# EAGLE board ARM_board (EAGLE 6.5.0), part 1 of 3
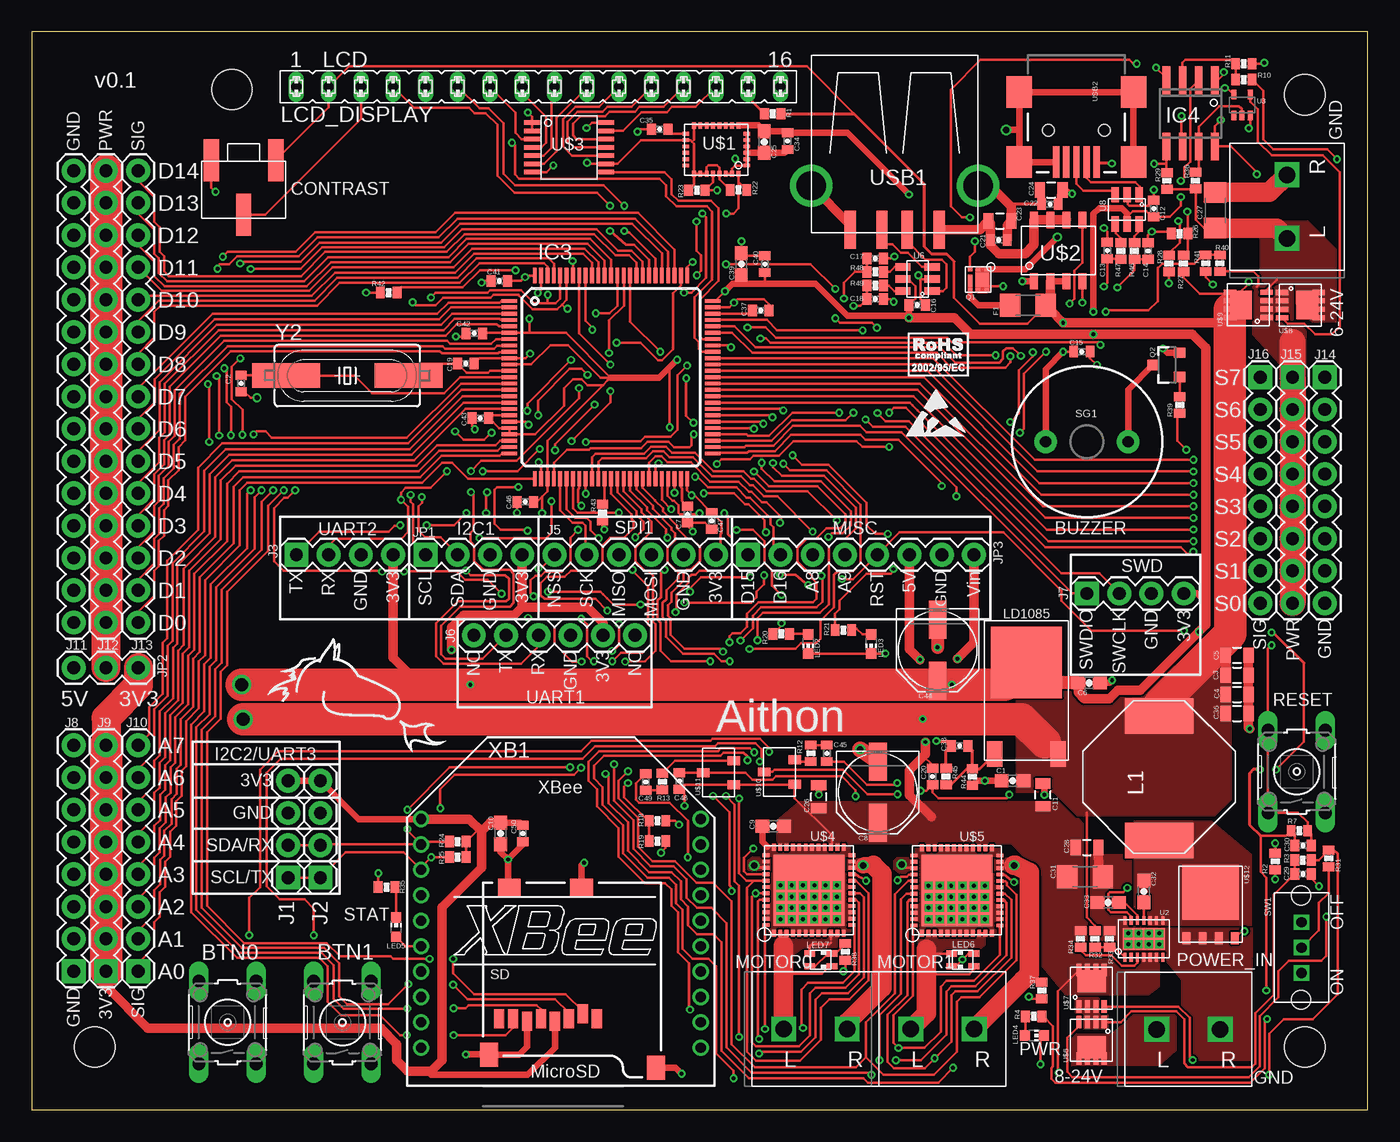
[diagram p2: board, top side]
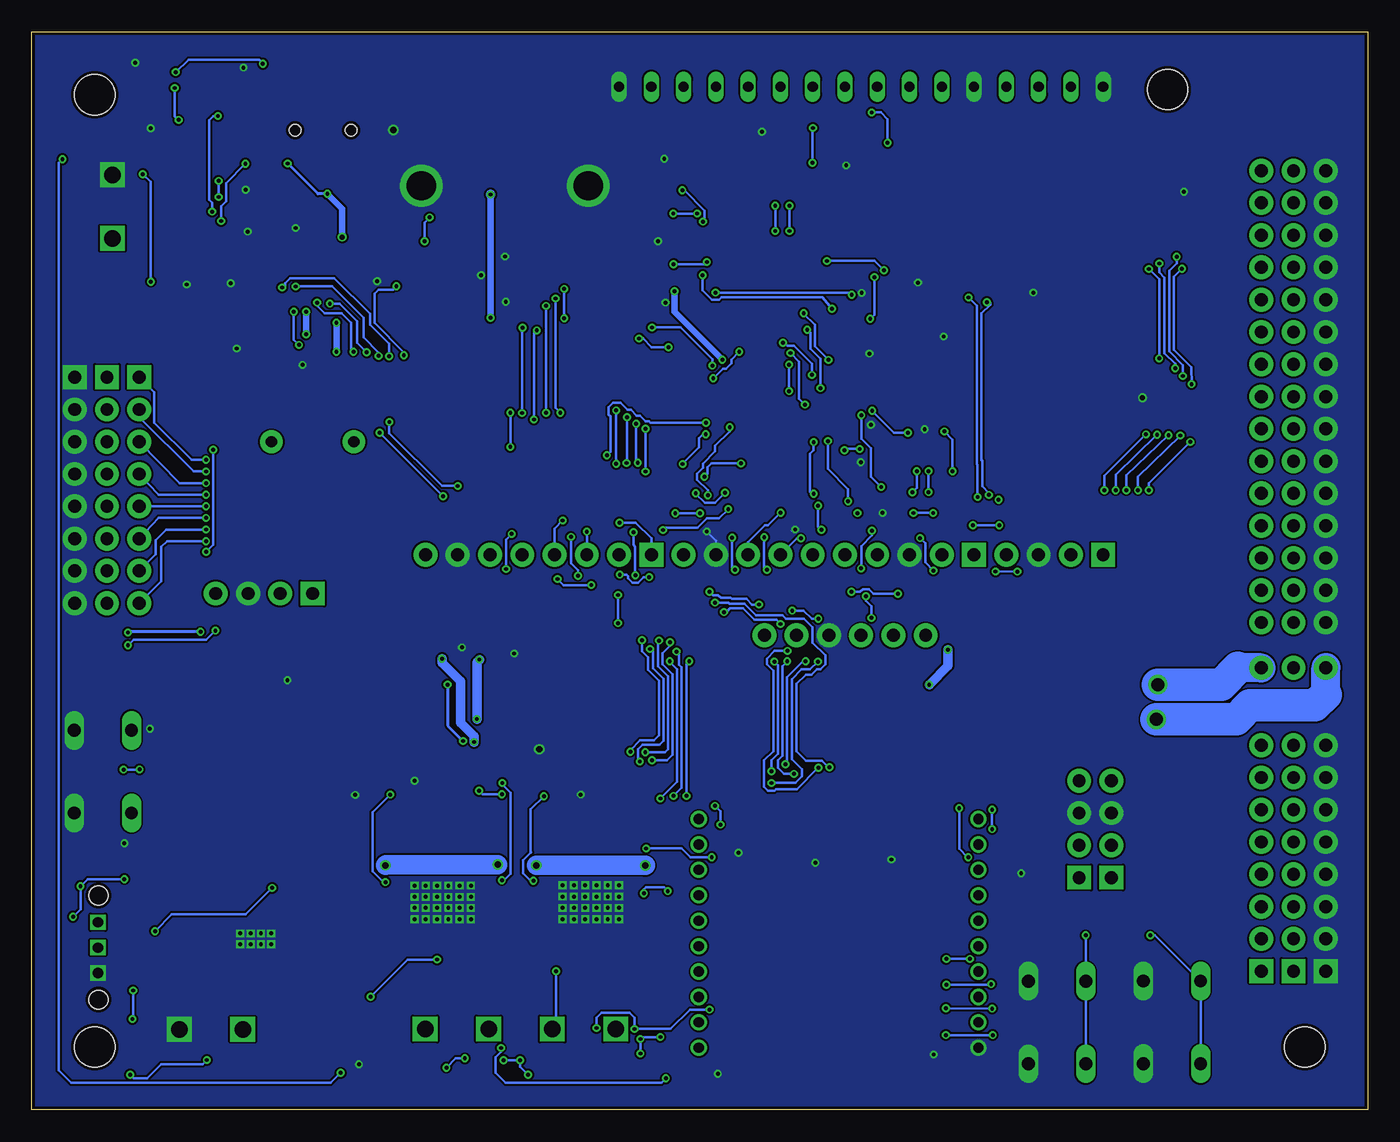
[diagram p3: board, bottom side, seen from below]

Size 105.16 x 84.84 mm. Coordinates in mm from the lower left corner, seen from the top.
Outline: 0,0 105.16,0 105.16,84.84 0,84.84 0,0
Copper layers (1*2*15*16): Top 0.035mm / dielectric 0.2mm / layer 2 0.0175mm / dielectric 1.1mm / layer 15 0.0175mm / dielectric 0.2mm / Bottom 0.035mm
Design rules: minimum track width 6mil, minimum drill 12mil, track to track 6mil, track to pad 6mil, pad to pad 6mil, via to via 6mil, smd to smd 0mil, copper to edge 10mil, drill to drill 10mil, minimum pad ring 6mil, minimum via ring 6mil, stop-mask expansion 2mil, vias tented up to drill 25mil, thermal gap 10mil
Holes 3.17 mm at 100.2,79.88 100.2,4.95 4.95,4.95 15.75,80.29
tKeepout: area 97,76.7 to 103.4,83.1; area 97,1.8 to 103.4,8.1; area 1.8,1.8 to 8.1,8.1; area 12.5,77.1 to 18.9,83.4
vRestrict: area 13.2,46.8 to 93.2,82.8

## Footprints (pad centres in the part's own frame; a part is rotated, then mirrored left to right if it is on the bottom)
B3F-10XX = drill 1.016 long: 1 -3.251,2.261; 2 3.251,2.261; 3 -3.251,-2.261; 4 3.251,-2.261
0603-CAP = smd 1.1 x 1: 1 -0.85,0; 2 0.85,0
0402-CAP = smd 0.7 x 0.9: 1 -0.65,0; 2 0.65,0
0805 = smd 0.8 x 1.2: 1 -0.9,0; 2 0.9,0
PANASONIC_D = smd 3 x 1.4: + 2.4,0; - -2.4,0
1206 = smd 1.6 x 1.8: 1 -1.4,0; 2 1.4,0
1206' = smd 1.6 x 1.8: 1 -0.13,2.54; 2 2.67,2.54
TQFP100 = smd 1.2 x 0.3: 1 -8,6; 2 -8,5.5; 3 -8,5; 4 -8,4.5; 5 -8,4; 6 -8,3.5; 7 -8,3; 8 -8,2.5; 9 -8,2; 10 -8,1.5; 11 -8,1; 12 -8,0.5; 13 -8,0; 14 -8,-0.5; 15 -8,-1; 16 -8,-1.5; 17 -8,-2; 18 -8,-2.5; 19 -8,-3; 20 -8,-3.5; 21 -8,-4; 22 -8,-4.5; 23 -8,-5; 24 -8,-5.5; 25 -8,-6; 51 8,-6; 52 8,-5.5; 53 8,-5; 54 8,-4.5; 55 8,-4; 56 8,-3.5; 57 8,-3; 58 8,-2.5; 59 8,-2; 60 8,-1.5; 61 8,-1; 62 8,-0.5; 63 8,0; 64 8,0.5; 65 8,1; 66 8,1.5; 67 8,2; 68 8,2.5; 69 8,3; 70 8,3.5; 71 8,4; 72 8,4.5; 73 8,5; 74 8,5.5; 75 8,6 | smd 0.3 x 1.2: 26 -6,-8; 27 -5.5,-8; 28 -5,-8; 29 -4.5,-8; 30 -4,-8; 31 -3.5,-8; 32 -3,-8; 33 -2.5,-8; 34 -2,-8; 35 -1.5,-8; 36 -1,-8; 37 -0.5,-8; 38 0,-8; 39 0.5,-8; 40 1,-8; 41 1.5,-8; 42 2,-8; 43 2.5,-8; 44 3,-8; 45 3.5,-8; 46 4,-8; 47 4.5,-8; 48 5,-8; 49 5.5,-8; 50 6,-8; 76 6,8; 77 5.5,8; 78 5,8; 79 4.5,8; 80 4,8; 81 3.5,8; 82 3,8; 83 2.5,8; 84 2,8; 85 1.5,8; 86 1,8; 87 0.5,8; 88 0,8; 89 -0.5,8; 90 -1,8; 91 -1.5,8; 92 -2,8; 93 -2.5,8; 94 -3,8; 95 -3.5,8; 96 -4,8; 97 -4.5,8; 98 -5,8; 99 -5.5,8; 100 -6,8
SO08 = smd 0.6 x 2.2: 1 -1.905,-2.6; 2 -0.635,-2.6; 3 0.635,-2.6; 4 1.905,-2.6; 5 1.905,2.6; 6 0.635,2.6; 7 -0.635,2.6; 8 -1.905,2.6
1X04 = drill 1.016 pad 1.88 square: 1 0,0 | drill 1.016 pad 1.88: 2 2.54,0; 3 5.08,0; 4 7.62,0
1X06 = drill 1.016 pad 1.88: 1 0,0; 2 2.54,0; 3 5.08,0; 4 7.62,0; 5 10.16,0; 6 12.7,0
1X08 = drill 1.016 pad 1.88 square: 1 0,0 | drill 1.016 pad 1.88: 2 2.54,0; 3 5.08,0; 4 7.62,0; 5 10.16,0; 6 12.7,0; 7 15.24,0; 8 17.78,0
1X15 = drill 1.016 pad 1.88: 1 0,0; 2 2.54,0; 3 5.08,0; 4 7.62,0; 5 10.16,0; 6 12.7,0; 7 15.24,0; 8 17.78,0; 9 20.32,0; 10 22.86,0; 11 25.4,0; 12 27.94,0; 13 30.48,0; 14 33.02,0; 15 35.56,0
1X03 = drill 1.016 pad 1.88: 1 0,0; 2 2.54,0; 3 5.08,0
INDUCTOR = smd 2.8 x 5.4: P$1 0,0; P$2 9.8,0
LCD = drill 0.8 long: A 16.51,0; DB0 -3.81,0; DB1 -1.27,0; DB2 1.27,0; DB3 3.81,0; DB4 6.35,0; DB5 8.89,0; DB6 11.43,0; DB7 13.97,0; E -6.35,0; K 19.05,0; R/W -8.89,0; RS -11.43,0; VDD -16.51,0; VO -13.97,0; VSS -19.05,0
DPAK = smd 1.2 x 2: 1 -2.5,-2.5; 3 2.5,-2.5 | smd 5.6 x 5.6: TAB 0,4.7
CHIP-LED0603 = smd 0.8 x 0.8: A 0,-0.75; C 0,0.75
LED-0606 = smd 0.85 x 0.5: 1 0.875,0.5; 2 -0.875,0.5; 3 0.875,-0.5; 4 -0.875,-0.5
2POS_TERMINAL = drill 1.3 square: L -5,0; R 0,0
POT = smd 1.194 x 3.302: 1 -2.54,0; 2 0,4.318; 3 2.54,0
POWERFLAT = smd 0.35 x 0.3: 1 -0.65,-0.825; 2 0,-0.825; 3 0.65,-0.825; 4 0.65,0.825; 5 0,0.825; 6 -0.65,0.825 | smd 0.35 x 0.95: 7 0.65,0.087 | smd 1.05 x 1.125: 8 -0.3,0
SOT23-3 = smd 0.8 x 0.9: 1 -0.95,-1; 2 0.95,-1; 3 0,1.1
0402-RES = smd 0.7 x 0.9: 1 -0.65,0; 2 0.65,0
MICRO-SD-SOCKET-PP = smd 0.8 x 1.5: 1 -8.94,10.7; 2 -7.84,10.3; 3 -6.74,10.7; 4 -5.64,10.9; 5 -4.54,10.7; 6 -3.44,10.9; 7 -2.34,10.7; 8 -1.24,10.7 | smd 1.8 x 1.4: CD1 -2.05,0.4; CD2 -7.75,0.4 | smd 1.4 x 1.9: GND1 -13.6,14.55; GND3 -0.45,13.55
BUZZER-12MM = drill 0.9 pad 1.778: + 3.25,0; - -3.25,0
SW = drill 0.8 square: P$1 0,0; P$2 2,0; P$3 -2,0 | hole 1.5: -4.1,-0.04; 4.1,-0.04
WDFN-14L = smd 0.25 x 0.7: 1 -1.5,-1.45; 2 -1,-1.45; 3 -0.5,-1.45; 4 0,-1.45; 5 0.5,-1.45; 6 1,-1.45; 7 1.5,-1.45; 8 1.5,1.45; 9 1,1.45; 10 0.5,1.45; 11 0,1.45; 12 -0.5,1.45; 13 -1,1.45; 14 -1.5,1.45 | smd 3.3 x 1.7: P$1 0,0
SC70 = smd 0.4 x 0.75: 1 -0.65,-0.825; 2 0,-0.825; 3 0.65,-0.825; 4 0.65,0.825; 5 -0.65,0.825
SOT23-6L = smd 1.2 x 0.6: P$1 -1.1,0.9; P$2 -1.1,-0.05; P$3 -1.1,-1; P$4 1.2,-1; P$5 1.2,-0.05; P$6 1.2,0.9
LGA-28 = smd 0.5 x 0.3: 1 -2.4,1.25; 2 -2.4,0.75; 3 -2.4,0.25; 4 -2.4,-0.25; 5 -2.4,-0.75; 6 -2.4,-1.25; 15 2.4,-1.25; 16 2.4,-0.75; 17 2.4,-0.25; 18 2.4,0.25; 19 2.4,0.75; 20 2.4,1.25 | smd 0.3 x 0.5: 7 -1.75,-1.9; 8 -1.25,-1.9; 9 -0.75,-1.9; 10 -0.25,-1.9; 11 0.25,-1.9; 12 0.75,-1.9; 13 1.25,-1.9; 14 1.75,-1.9; 21 1.75,1.9; 22 1.25,1.9; 23 0.75,1.9; 24 0.25,1.9; 25 -0.25,1.9; 26 -0.75,1.9; 27 -1.25,1.9; 28 -1.75,1.9
8-SOIC = smd 0.635 x 1.27: 1 -1.27,-1.778; 2 0,-1.778; 3 1.27,-1.778; 4 2.54,-1.778; 5 2.54,3.048; 6 1.27,3.048; 7 0,3.048; 8 -1.27,3.048
TSSOP-14 = smd 1.26 x 0.36: 1 -2.9,1.95; 2 -2.9,1.3; 3 -2.9,0.65; 4 -2.9,0; 5 -2.9,-0.65; 6 -2.9,-1.3; 7 -2.9,-1.95; 8 2.9,-1.95; 9 2.9,-1.3; 10 2.9,-0.65; 11 2.9,0; 12 2.9,0.65; 13 2.9,1.3; 14 2.9,1.95
VFQFPN48 = smd 0.55 x 0.3: 1 -3.375,2.75; 2 -3.375,2.25; 3 -3.375,1.75; 4 -3.375,1.25; 5 -3.375,0.75; 6 -3.375,0.25; 7 -3.375,-0.25; 8 -3.375,-0.75; 9 -3.375,-1.25; 10 -3.375,-1.75; 11 -3.375,-2.25; 12 -3.375,-2.75; 25 3.375,-2.75; 26 3.375,-2.25; 27 3.375,-1.75; 28 3.375,-1.25; 29 3.375,-0.75; 30 3.375,-0.25; 31 3.375,0.25; 32 3.375,0.75; 33 3.375,1.25; 34 3.375,1.75; 35 3.375,2.25; 36 3.375,2.75 | smd 0.3 x 0.55: 13 -2.75,-3.375; 14 -2.25,-3.375; 15 -1.75,-3.375; 16 -1.25,-3.375; 17 -0.75,-3.375; 18 -0.25,-3.375; 19 0.25,-3.375; 20 0.75,-3.375; 21 1.25,-3.375; 22 1.75,-3.375; 23 2.25,-3.375; 24 2.75,-3.375; 37 2.75,3.375; 38 2.25,3.375; 39 1.75,3.375; 40 1.25,3.375; 41 0.75,3.375; 42 0.25,3.375; 43 -0.25,3.375; 44 -0.75,3.375; 45 -1.25,3.375; 46 -1.75,3.375; 47 -2.25,3.375; 48 -2.75,3.375 | smd 5.6 x 5.6: PAD 0,0
POWERPAK1212-8 = smd 0.991 x 0.406: 1 -1.435,0.991; 2 -1.435,0.33; 3 -1.435,-0.33; 4 -1.435,-0.991; 5 1.435,0.991; 6 1.435,0.33; 7 1.435,-0.33; 8 1.435,-0.991 | smd 1.727 x 2.235: PAD 0.559,0
SOT-23 = smd 0.7 x 1: 1 -0.95,-1.2; 2 0.95,-1.2; 3 0,1.2
POWERFLAT5X6 = smd 0.62 x 0.95: 1 -1.905,-2.655; 2 -0.635,-2.655; 3 0.635,-2.655; 4 1.905,-2.655 | smd 4.41 x 4.33: 5 0,0.965
USB-A-S = smd 3 x 0.9: D+ 3.45,-1; D- 3.45,1; GND 3.45,-3.5; VBUS 3.45,3.5 | drill 2.311: GND@1 0,6.566; GND@2 0,-6.566
USB-MINIB = smd 2.5 x 0.5: D+ 2.5,0; D- 2.5,0.8; GND 2.5,-1.6; ID 2.5,-0.8; VBUS 2.5,1.6 | smd 2.5 x 2: MTN1 -3,4.5; MTN2 2.5,4.5; MTN3 -3,-4.5; MTN4 2.5,-4.5 | hole 0.9: 0,2.2; 0,-2.2
XBEE = drill 0.8 pad 1.27: 1 -11,9; 2 -11,7; 3 -11,5; 4 -11,3; 5 -11,1; 6 -11,-1; 7 -11,-3; 8 -11,-5; 9 -11,-7; 10 -11,-9; 11 11,-9; 12 11,-7; 13 11,-5; 14 11,-3; 15 11,-1; 16 11,1; 17 11,3; 18 11,5; 19 11,7; 20 11,9
HC49UP = smd 5.334 x 1.93: 1 -4.826,0; 2 4.826,0

## Placement (x,y rotation side)
BTN0  [B3F-10XX]  15.42,6.9 90 top
BTN1  [B3F-10XX]  24.46,6.88 90 top
C1  10u  [0603-CAP]  77.19,25.91 180 top
C2  20p  [0402-CAP]  16.48,57.18 270 top
C3  22u  [0805]  94.87,34.21 0 top
C4  22u  [0805]  94.87,32.69 0 top
C5  22u  [0805]  94.87,35.79 0 top
C6  10u  [0603-CAP]  83.21,33.6 0 top
C7  2.2u  [0402-CAP]  51.61,46.86 270 top
C8  100u  [PANASONIC_D]  66.6,24.99 270 top
C9  0.1u  [0603-CAP]  58.37,22.33 180 top
C10  1u  [0603-CAP]  36.91,21.76 270 top
C11  0.1u  [0805]  79.58,24.79 90 top
C12  0.1u  [0402-CAP]  88.32,70.92 90 top
C13  47p  [0402-CAP]  84.66,67.61 90 top
C14  47p  [0402-CAP]  87.86,67.59 90 top
C15  0.1u  [0402-CAP]  82.65,59.66 0 top
C16  0.1u  [0402-CAP]  69.7,63.35 0 top
C17  47p  [0402-CAP]  66.4,67.01 0 top
C18  47p  [0402-CAP]  66.4,63.8 0 top
C19  20p  [0402-CAP]  34.16,58.72 0 top
C20  .22u  [0402-CAP]  70.9,26.24 270 top
C21  0.1u  [0402-CAP]  76.12,68.45 0 top
C22  0.1u  [0402-CAP]  80.14,71.27 0 top
C23  10u  [0805]  76.2,69.95 0 top
C24  10u  [0805]  80.24,72.39 0 top
C25  10u  [0603-CAP]  57.66,76.17 270 top
C26  10u  [0805]  61.95,24.64 90 top
C27  22u  [1206]  93.14,70.79 90 top
C28  10u  [0805]  83.06,20.65 0 top
C29  0.1u  [0402-CAP]  100.05,18.57 0 top
C30  10n  [0402-CAP]  100.05,20.8 0 top
C31  22u  [1206]  82.91,18.36 0 top
C32  1u  [0603-CAP]  87.53,17.2 90 top
C33  10u  [0603-CAP]  84.73,16.33 0 top
C34  0.1u  [0402-CAP]  59.49,76.23 270 top
C35  10n  [0402-CAP]  49.43,77.17 180 top
C36  22u  [0805]  94.87,31.19 0 top
C37  2.2u  [0402-CAP]  57.38,62.92 0 top
C38  0.1u  [0402-CAP]  73.03,28.65 0 top
C39  4.7u  [0603-CAP]  55.85,66.55 90 top
C40  0.1u  [0402-CAP]  57.71,66.55 90 top
C41  0.1u  [0402-CAP]  36.8,65.23 180 top
C42  0.1u  [0402-CAP]  34.82,61.11 180 top
C43  0.1u  [0402-CAP]  35.31,54.43 180 top
C44  220u  [PANASONIC_D]  71.3,36.17 270 top
C45  10n  [0402-CAP]  62.59,28.07 270 top
C46  1u  [0402-CAP]  38.84,47.85 180 top
C47  10n  [0402-CAP]  53.52,46.35 270 top
C48  .22u  [0402-CAP]  50.98,25.88 90 top
C49  10n  [0402-CAP]  48.34,25.81 90 top
C50  8.2p  [0402-CAP]  38.65,21.76 270 top
F1  1A  [1206']  77.14,60.78 0 top
IC3  STM32F437VI  [TQFP100]  45.59,57.66 0 top
IC4  LM358DT  [SO08]  91.21,78.41 180 top
J1  USART/I2C  [1X04]  20.18,18.29 90 top
J2  I2C2/USART3  [1X04]  22.72,18.29 90 top
J3  USART2  [1X04]  20.83,43.69 0 top
J5  SPI  [1X06]  53.85,43.69 180 top
J6  Bluesmirf  [1X06]  34.8,37.34 0 top
J7  SWD  [1X04]  83.06,40.64 0 top
J8  AGND  [1X08]  3.3,10.92 90 top
J9  APWR  [1X08]  5.84,10.92 90 top
J10  ANALOG  [1X08]  8.38,10.92 90 top
J11  DGND  [1X15]  3.3,38.35 90 top
J12  DPWR  [1X15]  5.84,38.35 90 top
J13  DIGITAL  [1X15]  8.38,38.35 90 top
J14  SGND  [1X08]  101.78,57.66 270 top
J15  SPWR  [1X08]  99.24,57.66 270 top
J16  SERVO  [1X08]  96.7,57.66 270 top
JP1  I2C1  [1X04]  30.99,43.69 0 top
JP2  DPWR_SEL  [1X03]  8.38,34.8 180 top
JP3  MISC  [1X08]  56.39,43.69 0 top
L1  2.7u  [INDUCTOR]  88.72,21.21 90 top
LCD  LCD_DISPLAY  [LCD]  39.88,80.52 0 top
LD1085  AP1084  [DPAK]  78.28,30.51 0 top
LED2  YELLOW  [CHIP-LED0603]  61.11,36.66 180 top
LED3  YELLOW  [CHIP-LED0603]  66.08,36.66 180 top
LED4  RED  [CHIP-LED0603]  78.92,5.85 270 top
LED5  YELLOW  [CHIP-LED0603]  28.68,14.39 0 top
LED6  LED_R/G  [LED-0606]  73.28,11.81 0 top
LED7  LED_R/G  [LED-0606]  62.1,11.81 180 top
MOTOR0  2POS_TERMINAL  [2POS_TERMINAL]  64.19,6.38 0 top
MOTOR1  2POS_TERMINAL  [2POS_TERMINAL]  74.19,6.38 0 top
POT  10K  [POT]  16.68,74.74 180 top
POWER  2POS_TERMINAL  [2POS_TERMINAL]  93.55,6.35 0 top
Q1  STL4P2UH7  [POWERFLAT]  74.5,65.33 180 top
Q2  2STR1230  [SOT23-3]  89.36,58.62 90 top
R1  10  [0402-RES]  58.32,78.38 0 top
R2  100k  [0402-RES]  97.87,19.56 90 top
R3  100k  [0402-RES]  100.05,19.66 180 top
R4  220  [0402-RES]  78.87,7.37 0 top
R7  10k  [0402-RES]  99.77,21.97 180 top
R10  10k  [0402-RES]  95.4,81.08 0 top
R11  10k  [0402-RES]  95.4,82.32 180 top
R12  100  [0402-RES]  61.32,28.07 270 top
R13  100  [0402-RES]  49.63,25.83 90 top
R18  93.1k  [0402-RES]  49.25,22.76 180 top
R19  10k  [0402-RES]  49.25,21.16 0 top
R20  220  [0402-RES]  59,37.46 180 top
R21  220  [0402-RES]  63.89,37.76 180 top
R22  4.7k  [0402-RES]  55.63,72.39 180 top
R23  4.7k  [0402-RES]  52.35,72.36 180 top
R24  4.7k  [0402-RES]  33.53,21.11 0 top
R25  4.7k  [0402-RES]  33.53,19.9 0 top
R26  10k  [0402-RES]  90.35,68.96 0 top
R27  39k  [0402-RES]  90.65,66.6 270 top
R28  10k  [0402-RES]  89.51,66.6 270 top
R29  39k  [0402-RES]  89.36,73.1 90 top
R31  10k  [0402-RES]  102.08,19.8 270 top
R32  93.1k  [0402-RES]  83.69,13.46 90 top
R33  18k  [0402-RES]  84.84,13.46 270 top
R34  100k  [0402-RES]  82.55,13.46 90 top
R35  220  [0402-RES]  27.93,17.54 0 top
R36  10k  [0402-RES]  91.59,73.13 270 top
R37  2k  [0402-RES]  79.5,9.4 270 top
R38  2k  [0402-RES]  64.03,12.45 90 top
R39  10k  [0402-RES]  90.35,55.47 90 top
R40  93.1k  [0402-RES]  93.52,66.62 90 top
R41  10k  [0402-RES]  92.41,66.62 270 top
R42  10k  [0402-RES]  28.09,64.31 0 top
R43  10k  [0402-RES]  44.92,47.01 90 top
R44  2k  [0402-RES]  74.04,26.21 90 top
R45  1.21k  [0402-RES]  71.96,26.24 90 top
R46  15  [0402-RES]  86.79,67.59 270 top
R47  15  [0402-RES]  85.73,67.59 270 top
R48  15  [0402-RES]  66.4,65.94 180 top
R49  15  [0402-RES]  66.4,64.87 180 top
RESET  [B3F-10XX]  99.57,26.62 90 top
SD  USD-SOCKETNEW  [MICRO-SD-SOCKET-PP]  35.53,17.88 180 top
SERVO_PWR  2POS_TERMINAL  [2POS_TERMINAL]  98.81,73.58 90 top
SG1  BUZZERPTH  [BUZZER-12MM]  83.06,52.58 180 top
SW1  SW  [SW]  99.95,12.78 270 top
U2  RT7259  [WDFN-14L]  87.53,13.46 0 top
U3  NC7SZU04  [SC70]  95.25,79.07 0 top
U6  USBLC6-2  [SOT23-6L]  69.77,65.33 180 top
U8  USBLC6-2  [SOT23-6L]  86.26,70.92 270 top
U$1  LSM330DLC  [LGA-28]  53.87,75.57 180 top
U$2  STMPS2171MTR  [8-SOIC]  80.16,66.98 0 top
U$3  MC74HC164  [TSSOP-14]  42.29,75.74 0 top
U$4  L6206Q  [VFQFPN48]  61.16,17.3 90 top
U$5  L6206Q  [VFQFPN48]  72.82,17.27 90 top
U$6  SI7617  [POWERPAK1212-8]  83.41,5.49 270 top
U$7  SI7617  [POWERPAK1212-8]  83.41,9.58 90 top
U$8  SI7617  [POWERPAK1212-8]  99.83,63.33 0 top
U$9  SI7617  [POWERPAK1212-8]  95.75,63.35 180 top
U$10  BAV99  [SOT-23]  58.85,26.59 90 top
U$11  BAV99  [SOT-23]  54.05,26.54 90 top
U$12  STL85N6F3  [POWERFLAT5X6]  92.79,16.18 0 top
USB1  USB-A-S  [USB-A-S]  67.92,72.72 270 top
USB2  USB-MINIB-5PIN  [USB-MINIB]  82.22,77.09 270 top
XB1  XBEE  [XBEE]  41.66,13.89 0 top
Y2  8MHz  [HC49UP]  24.84,57.78 0 top